# EAGLE design interstage_A1 (EAGLE 9.2.2)
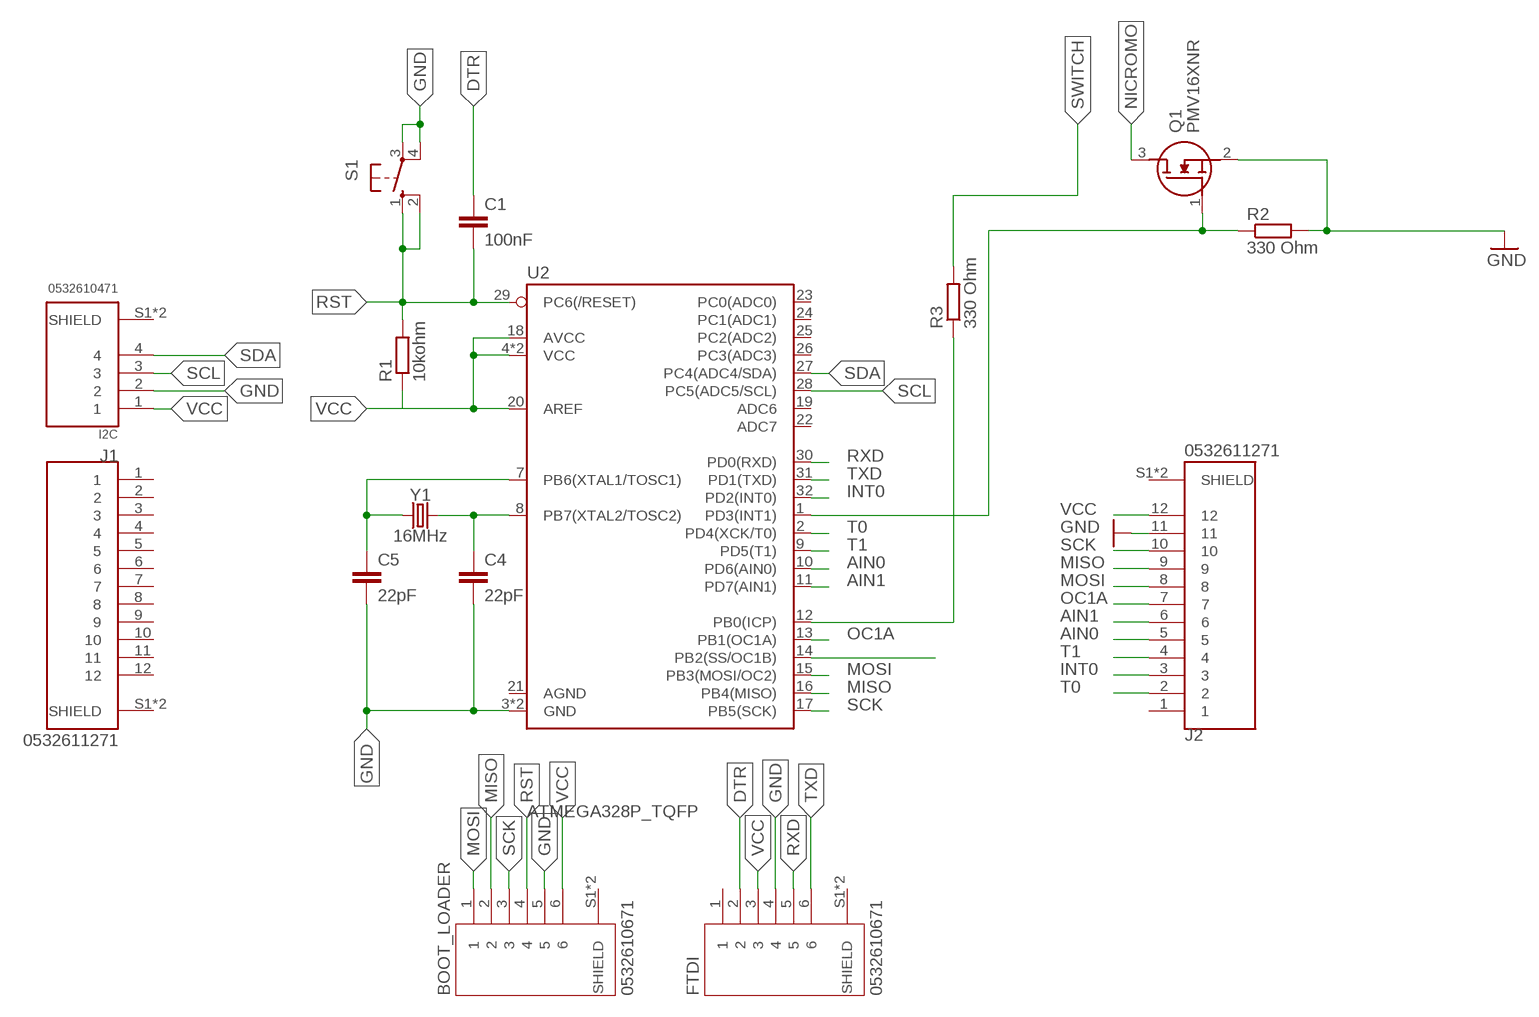
[diagram p0: schematic, sheet 1]

## Parts
BOOT_LOADER  0532610671  [MOLEX_0532610671]
C1  100nF  C-EUC0805K  [C0805K]
C4  22pF  C-EUC0603K  [C0603K]
C5  22pF  C-EUC0603K  [C0603K]
FTDI  0532610671  [MOLEX_0532610671]
I2C  0532610471  [MOLEX_0532610471]
J1  0532611271  [MOLEX_0532611271]
J2  0532611271  [MOLEX_0532611271]
Q1  PMV16XNR  [SOT95P230X110-3N]
R1  10kohm  R-EU_R1206  [R1206]
R2  330 Ohm  R-EU_R1206  [R1206]
R3  330 Ohm  R-EU_R1206  [R1206]
S1  10-XX  [B3F-10XX]
U2  ATMEGA328P_TQFP  [TQFP32-08]
Y1  16MHz  CRYSTAL-16MHZSMD-2X1.6  [CRYSTAL-SMD-2.0X1.6MM]

## Nets
AIN0: J2.5 U2.10(PD6(AIN0))
AIN1: J2.6 U2.11(PD7(AIN1))
DTR: C1.1 FTDI.2
GND: BOOT_LOADER.5 C4.2 C5.2 FTDI.4 I2C.2 J2.11 Q1.2(S) R2.2 S1.3(P) S1.4(P1) U2.3(GND) U2.5(GND)
ICP: R3.1 U2.12(PB0(ICP))
INT0: J2.3 U2.32(PD2(INT0))
INT1: Q1.1(G) R2.1 U2.1(PD3(INT1))
MISO: BOOT_LOADER.2 J2.9 U2.16(PB4(MISO))
MOSI: BOOT_LOADER.1 J2.8 U2.15(PB3(MOSI/OC2))
N$1: C5.1 U2.7(PB6(XTAL1/TOSC1)) Y1.1
N$2: C4.1 U2.8(PB7(XTAL2/TOSC2)) Y1.3
N$6: U2.14(PB2(SS/OC1B))
NICROMO: Q1.3(D)
OC1A: J2.7 U2.13(PB1(OC1A))
RST: BOOT_LOADER.4 C1.2 R1.2 S1.1(S) S1.2(S1) U2.29(PC6(/RESET))
RXD: FTDI.5 U2.30(PD0(RXD))
SCK: BOOT_LOADER.3 J2.10 U2.17(PB5(SCK))
SCL: I2C.3 U2.28(PC5(ADC5/SCL))
SDA: I2C.4 U2.27(PC4(ADC4/SDA))
SWITCH: R3.2
T0: J2.2 U2.2(PD4(XCK/T0))
T1: J2.4 U2.9(PD5(T1))
TXD: FTDI.6 U2.31(PD1(TXD))
VCC: BOOT_LOADER.6 FTDI.3 I2C.1 J2.12 R1.1 U2.4(VCC) U2.6(VCC) U2.18(AVCC) U2.20(AREF)
Unconnected: BOOT_LOADER.S1(SHIELD) BOOT_LOADER.S2(SHIELD) FTDI.1 FTDI.S1(SHIELD) FTDI.S2(SHIELD) I2C.S1(SHIELD) I2C.S2(SHIELD) J1.1 J1.2 J1.3 J1.4 J1.5 J1.6 J1.7 J1.8 J1.9 J1.10 J1.11 J1.12 J1.S1(SHIELD) J1.S2(SHIELD) J2.1 J2.S1(SHIELD) J2.S2(SHIELD) U2.19(ADC6) U2.21(AGND) U2.22(ADC7) U2.23(PC0(ADC0)) U2.24(PC1(ADC1)) U2.25(PC2(ADC2)) U2.26(PC3(ADC3))

## Library data of the parts
BOOT_LOADER FTDI = picoblade6:0532610671: 1.25mm Pitch PicoBlade™ Header, Surface Mount, Right Angle, 6 Circuits; DESCRIPTION: Picoblade Connector, 6 Circuit Single Row, Right Angle Surface Mount SMT PCB; DIGI-KEY_PART_NUMBER: WM7624CT-ND; DIGI-KEY_PURCHASE_URL: https://www.digikey.com/product-detail/en/molex/0532610671/WM7624CT-ND/699111?utm_source=snapeda&utm_medium=aggregator&utm_campaign=symbol; MF: Molex; MP: 0532610671; PACKAGE: None
C1 C4 C5 = rcl:C-EU: CAPACITOR, European symbol; SPICEPREFIX: C
I2C = 0532610471:0532610471: Conn Shrouded Header HDR 4 POS 1.25mm Solder RA SMD PicoBlade™ Embossed T/R; AVAILABILITY: Unavailable; DESCRIPTION: Picoblade Connector, 4 Circuit Single Row, Right Angle Surface Mount SMT PCB; MF: Molex; MP: 0532610471; PACKAGE: None; PRICE: None
J1 J2 = picoblade:0532611271: Conn Shrouded Header HDR 12 POS 1.25mm Solder RA SMD PicoBlade; AVAILABILITY: Unavailable; DESCRIPTION: Picoblade Connector, 12 Circuit Single Row, Right Angle Surface Mount SMT PCB; MF: Molex; MP: 0532611271; PACKAGE: None; PRICE: None
Q1 = SamacSys_Parts:PMV16XNR: Nexperia PMV16XNR N-channel MOSFET, 8.6 A, 20 V PMV16XN, 3-Pin SOT-23 Source: Datasheet <https://componentsearchengine.com/Datasheets/1/PMV16XNR.pdf>; DESCRIPTION: Nexperia PMV16XNR N-channel MOSFET, 8.6 A, 20 V PMV16XN, 3-Pin SOT-23; HEIGHT: 1.1mm; MANUFACTURER_NAME: Nexperia; MANUFACTURER_PART_NUMBER: PMV16XNR; MOUSER_PART_NUMBER: 771-PMV16XNR; MOUSER_PRICE-STOCK: https://www.mouser.com/Search/Refine.aspx?Keyword=771-PMV16XNR
R1-R3 = rcl:R-EU_: RESISTOR, European symbol; SPICEPREFIX: R
S1 = switch-omron:10-XX: OMRON SWITCH; MPN: B3F-1000; OC_FARNELL: 176432; OC_NEWARK: 36M3542
U2 = SparkFun-IC-Microcontroller:ATMEGA328P_TQFP: Popular 328P in QFP Storefront component: ATmega328 - TQFP <https://www.sparkfun.com/products/13448> (COM-13448) Datasheet <http://www.sparkfun.com/datasheets/Components/SMD/ATMega328.pdf> SparkFun Products SparkFun RedBoard - Programmed with Arduino <https://www.sparkfun.com/products/12757> (DEV-12757) Arduino Pro Mini 328 - 5V/16MHz <https://www.sparkfun.com/products/11113> (DEV-11113) Arduino Pro Mini 328 - 3.3V/8MHz <https://www.sparkfun.com/products/11114> (DEV-11114) SparkFun OpenLog <https://www.sparkfun.com/products/13712> (DEV-13712) SparkFun MicroView - OLED Arduino Module <https://www.sparkfun.com/products/12923> (DEV-12923) SparkFun Digital Sandbox <https://www.sparkfun.com/products/12651> (DEV-12651) SparkFun PicoBoard <https://www.sparkfun.com/products/11888> (WIG-11888) Arduino Fio <https://www.sparkfun.com/products/10116> (DEV-10116) LilyPad Arduino 328 Main Board <https://www.sparkfun.com/products/13342> (DEV-13342) SparkFun RedStick <https://www.sparkfun.com/products/13741> (DEV-13741) LilyPad MP3 <https://www.sparkfun.com/products/11013> (DEV-11013) LilyPad Arduino SimpleSnap <https://www.sparkfun.com/products/10941> (DEV-10941) SparkFun Stepoko <https://www.sparkfun.com/products/13899> (ROB-13899) SparkFun Geiger Counter <https://www.sparkfun.com/products/11345> (SEN-11345) SparkFun EL Sequencer <https://www.sparkfun.com/products/12781> (COM-12781) Arduino Pro 328 - 5V/16MHz <https://www.sparkfun.com/products/10915> (DEV-10915) CryptoCape <https://www.sparkfun.com/products/12773> (DEV-12773) SparkFun IR Thermometer Evaluation Board - MLX90614 <https://www.sparkfun.com/products/10740> (SEN-10740) SparkFun RedBot Mainboard <https://www.sparkfun.com/products/12097> (ROB-12097) Arduino Pro 328 - 3.3V/8MHz <https://www.sparkfun.com/products/10914> (DEV-10914) SparkFun Block for Intel® Edison - Arduino <https://www.sparkfun.com/products/13036> (DEV-13036) SparkFun Simon Says - Surface Mount Soldering Kit <https://www.sparkfun.com/products/10935> (KIT-10935) SparkFun 7-Segment Serial Display - Red <https://www.sparkfun.com/products/11441> (COM-11441) SparkFun 7-Segment Serial Display - White <https://www.sparkfun.com/products/11629> (COM-11629) SparkFun 7-Segment Serial Display - Yellow <https://www.sparkfun.com/products/11443> (COM-11443) SparkFun 7-Segment Serial Display - Kelly Green <https://www.sparkfun.com/products/11440> (COM-11440) SparkFun 7-Segment Serial Display - Blue <https://www.sparkfun.com/products/11442> (COM-11442) SparkFun OpenSegment Serial Display - 20mm (Blue) <https://www.sparkfun.com/products/11647> (COM-11647) SparkFun OpenSegment Serial Display - 20mm (Green) <https://www.sparkfun.com/products/11646> (COM-11646) SparkFun OpenSegment Serial Display - 20mm (White) <https://www.sparkfun.com/products/11648> (COM-11648) SparkFun OpenSegment Serial Display - 20mm (Red) <https://www.sparkfun.com/products/11644> (COM-11644) SparkFun OpenSegment Serial Display - 20mm (Yellow) <https://www.sparkfun.com/products/11645> (COM-11645) SparkFun OpenSegment Shield <https://www.sparkfun.com/products/13190> (DEV-13190); PROD_ID: IC-09069
Y1 = SparkFun-Clocks:CRYSTAL-16MHZ: 16MHz Crystal Digikey Example <http://www.digikey.com/product-search/en?keywords=535-9122-1-ND> Frequency: 16MHz Frequency Stability: ±50ppm Frequency Tolerance: ±20ppm Load Capacitance: 18pF SparkFun Products: Pro Micro -5V/16MHz <https://www.sparkfun.com/products/12640> SparkFun Serial Enabled LCD Kit <https://www.sparkfun.com/products/10097>; PROD_ID: XTAL-14681

## Board
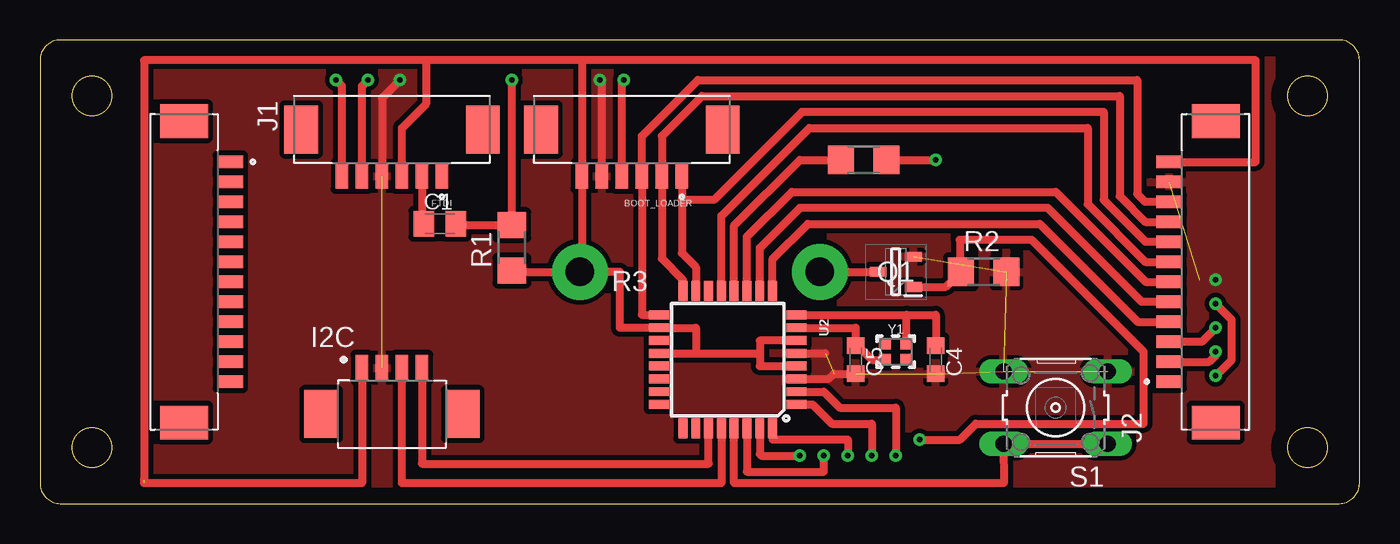
[diagram p1: board, top side]
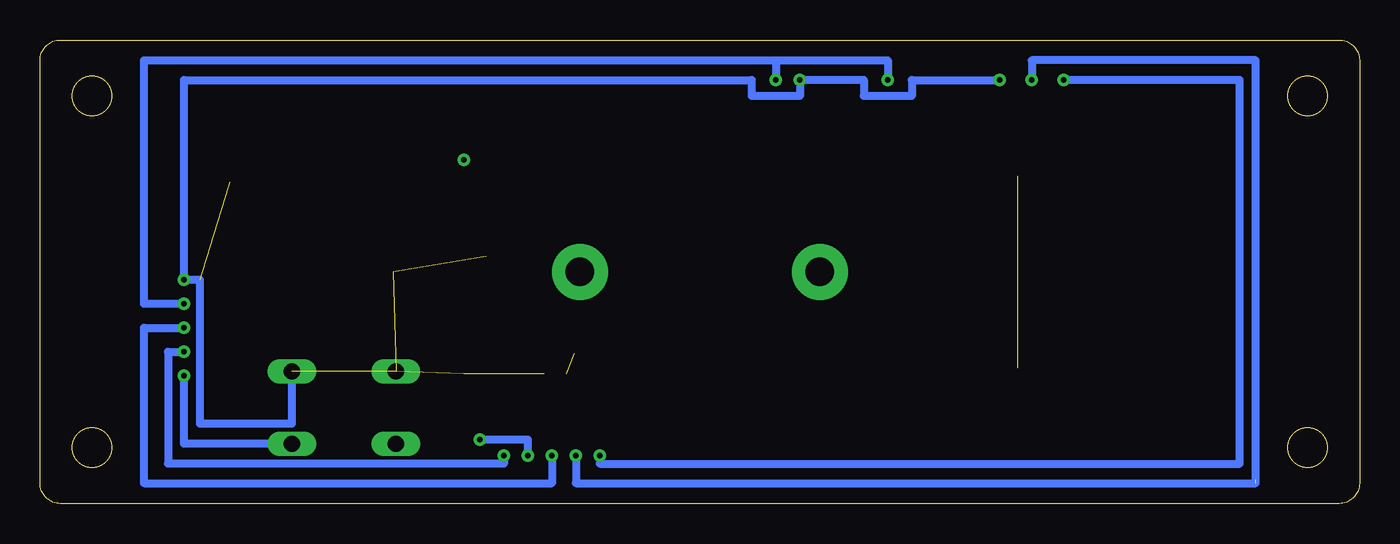
[diagram p2: board, bottom side, seen from below]

Size 82.5 x 29 mm. Coordinates in mm from the lower left corner, seen from the top.
Outline: 0,1.27 arc90 1.27,0 81.23,0 arc90 82.5,1.27 82.5,27.73 arc90 81.23,29 1.27,29 arc90 0,27.73 0,1.27
Outline: circle at 79.25,3.5 radius 1.25
Outline: circle at 3.25,25.5 radius 1.25
Outline: circle at 3.25,3.5 radius 1.25
Outline: circle at 79.25,25.5 radius 1.25
Copper layers (1*16): Top 0.035mm / dielectric 1.5mm / Bottom 0.035mm
Design rules "default": minimum track width 6mil, minimum drill 0.35mm, track to track 6mil, track to pad 6mil, pad to pad 6mil, via to via 6mil, smd to smd 6mil, copper to edge 40mil, drill to drill 6mil, minimum pad ring 10mil, minimum via ring 8mil, stop-mask expansion 4mil, vias tented up to drill 0mil, thermal gap 10mil

### Footprints (pad centres in the part's own frame; a part is rotated, then mirrored left to right if it is on the bottom)
MOLEX_0532610671 = smd 0.8 x 1.6: 1 -3.125,0; 2 -1.875,0; 3 -0.625,0; 4 0.625,0; 5 1.875,0; 6 3.125,0 | smd 2.1 x 3: S1 -5.675,-2.9; S2 5.675,-2.9
C0805K = smd 1.3 x 1.6: 1 -1,0; 2 1,0
C0603K = smd 1.05 x 1.08: 1 -0.875,0; 2 0.875,0
MOLEX_0532610471 = smd 0.8 x 1.6: 1 -1.875,0; 2 -0.625,0; 3 0.625,0; 4 1.875,0 | smd 2.1 x 3: S1 -4.425,-2.9; S2 4.425,-2.9
MOLEX_0532611271 = smd 0.8 x 1.6: 1 -6.875,2.9; 2 -5.625,2.9; 3 -4.375,2.9; 4 -3.125,2.9; 5 -1.875,2.9; 6 -0.625,2.9; 7 0.625,2.9; 8 1.875,2.9; 9 3.125,2.9; 10 4.375,2.9; 11 5.625,2.9; 12 6.875,2.9 | smd 2.1 x 3: S1 -9.425,0; S2 9.425,0
SOT95P230X110-3N = smd 1.05 x 0.6: 1 -1.1,0.95; 2 -1.1,-0.95; 3 1.1,0
R1206 = smd 1.6 x 1.803: 1 -1.422,0; 2 1.422,0
B3F-10XX = drill 1.016 long: 1 -3.251,2.261; 2 3.251,2.261; 3 -3.251,-2.261; 4 3.251,-2.261
TQFP32-08 = smd 1.27 x 0.559: 1 -4.293,2.8; 2 -4.293,2; 3 -4.293,1.2; 4 -4.293,0.4; 5 -4.293,-0.4; 6 -4.293,-1.2; 7 -4.293,-2; 8 -4.293,-2.8; 17 4.293,-2.8; 18 4.293,-2; 19 4.293,-1.2; 20 4.293,-0.4; 21 4.293,0.4; 22 4.293,1.2; 23 4.293,2; 24 4.293,2.8 | smd 0.559 x 1.27: 9 -2.8,-4.293; 10 -2,-4.293; 11 -1.2,-4.293; 12 -0.4,-4.293; 13 0.4,-4.293; 14 1.2,-4.293; 15 2,-4.293; 16 2.8,-4.293; 25 2.8,4.293; 26 2,4.293; 27 1.2,4.293; 28 0.4,4.293; 29 -0.4,4.293; 30 -1.2,4.293; 31 -2,4.293; 32 -2.8,4.293
CRYSTAL-SMD-2.0X1.6MM = smd 0.75 x 0.7: 1 -0.675,-0.5; 2 0.675,-0.5; 3 0.675,0.5; 4 -0.675,0.5

### Placement (x,y rotation side)
BOOT_LOADER  37,20.5 180 top
C1  25,17.5 0 top
C4  56,9 270 top
C5  51,9 270 top
FTDI  22,20.5 180 top
I2C  22,8.5 0 top
J1  9,14.5 270 top
J2  73.5,14.5 90 top
Q1  53.5,14.5 180 top
R1  29.5,16 90 top
R2  59,14.5 0 top
R3  51.5,21.5 0 top
S1  63.5,6 180 top
U2  43,9 180 top
Y1  53.5,9.5 0 top

### Tracks (layer width: path | path; a pad name or v marks a point on that pad's centre or on a via)
AIN0
  Top 0.5: 70.47,12.5 J2.5 68.88,12.62 63,18.5 47.5,18.5 45,16 U2.10
AIN1
  Top 0.5: U2.11 44.2,16.7 47,19.5 63.5,19.5 69.12,13.88 J2.6
DTR
  Top 0.5: C1.1 24,17.38 23.88,17.5 FTDI.2
GND  (via drill 0.35)  (8 unrouted)
  Top 0.5: U2.5 49.1,9.4 | C5.2 49.62,8.12 49.3,7.8 U2.3 | BOOT_LOADER.5 35.12,26.5 v35,26.5 | v22.5,26.5 21.38,25.38 FTDI.4
  Bottom 0.5: v22.5,26.5 28,26.5 28,25.5 31,25.5 31,26.5 v35,26.5 35,25.5 38,25.5 38,26.5 73.5,26.5 v73.5,14 72.5,14 72.5,5 66.75,5 S1.3
  pour Top (isolate 0.305): 6,28.5 6,0.5 77,0.5 77,28.5
ICP
  Top 0.5: R3.1 47.5,21.5 43.4,17.4 U2.12
INT0  (via drill 0.35)
  Top 0.5: U2.32 45.8,4 50.5,4 v50.5,3 | v73.5,11 72.62,10.12 J2.3
  Bottom 0.5: v50.5,3 50.5,1.27 76,1.27 76,11 v73.5,11
INT1  (via drill 0.35)
  Top 0.5: Q1.1 56.63,13.55 R2.1 57.5,14.58 57.5,16.5 62,16.5 69,9.5 69,5 58.5,5 57.5,4 v55,4 | U2.1 48.3,6.2 49.5,5 52,5 v52,3
  Bottom 0.5: v52,3 52,4 v55,4
MISO
  Top 0.5: U2.16 40.2,14 38.88,15.32 BOOT_LOADER.2 38.88,23 41.38,25.5 67.5,25.5 67.5,19.23 69.1,17.62 J2.9
MOSI
  Top 0.5: J2.8 69.12,16.38 66.5,19 66.5,24.5 47.62,24.5 42.12,19 40.12,19 | U2.15 41,14.79 40.12,15.67 40.12,19 | BOOT_LOADER.1 40.12,19
N$1
  Top 0.5: U2.7 51,11 C5.1 51.12,9.88 52,9 Y1.1
N$2
  Top 0.5: U2.8 54.17,11.8 | Y1.3 54.17,11.8 | C4.1 56,11.8 54.17,11.8
NICROMO  (via drill 1.8 pad 3.5)
  Top 0.5: 50.5,14.5 v48.75,14.5 Q1.3
OC1A
  Top 0.5: J2.7 69.1,15.12 65.5,18.73 65.5,23.5 48.1,23.5 42.6,18 U2.13
RST  (via drill 0.35)
  Top 0.5: U2.29 43.4,1.27 60.26,1.27 S1.2 S1.1 | BOOT_LOADER.4 36.38,26.5 v36.5,26.5 | C1.2 26.08,17.42 R1.2 v29.5,26.5 | v73.5,8 74.5,9 74.5,11.5 v73.5,12.5
  Bottom 0.5: S1.1 73.5,3.74 v73.5,8 | v73.5,12.5 76,12.5 76,27.73 36.5,27.73 | 36.5,27.73 v36.5,26.5 | 36.5,27.73 29.5,27.73 v29.5,26.5
RXD  (via drill 0.35)
  Top 0.5: U2.30 44.2,2 49,2 v49,3 | FTDI.5 20.12,26.12 v20.5,26.5
  Bottom 0.5: v49,3 49,1.27 6.5,1.27 6.5,27.73 20.5,27.73 v20.5,26.5
SCK
  Top 0.5: U2.17 37.62,11.8 BOOT_LOADER.3 37.62,23 40.06,25.44 41.12,26.5 68.6,26.5 68.6,19.38 69.1,18.88 J2.10
SCL
  Top 0.5: U2.28 42.6,1.27 22.62,1.27 I2C.3
SDA
  Top 0.5: U2.27 41.8,2.5 23.88,2.5 I2C.4
SWITCH  (via drill 0.35)
  Top 0.5: R3.2 v56,21.5
T0  (via drill 0.35)
  Top 0.5: J2.2 73.1,8.88 73.5,9.28 v73.5,9.5 | U2.2 49,7 50,6 53.5,6 v53.5,3
  Bottom 0.5: v73.5,9.5 74.5,9.5 74.5,2.5 53.5,2.5 v53.5,3
T1
  Top 0.5: U2.9 45.8,15.3 48,17.5 62.5,17.5 68.62,11.38 J2.4
TXD  (via drill 0.35)
  Top 0.5: v47.5,3 45.1,3 45,3.1 U2.31 | FTDI.6 18.88,26.12 v18.5,26.5
  Bottom 0.5: v47.5,3 47.5,2.5 7.5,2.5 7.5,26.5 v18.5,26.5
VCC  (via drill 1.8 pad 3.5)  (1 unrouted)
  Top 0.5: J2.12 76,21.38 76,27.73 33.88,27.73 | U2.4 45,8.6 45,9.4 | U2.6 45,10.2 45,9.4 | U2.20 41,9.4 | 41,9.4 45,9.4 | 41,9.4 41,11 U2.18 36.25,11 36.25,14.5 33.88,14.5 | I2C.1 20.12,1.27 6.5,1.27 | 33.88,27.73 BOOT_LOADER.6 | 33.88,27.73 24.12,27.73 | 24.12,27.73 6.5,27.73 6.5,1.5 | 24.12,27.73 24.12,25 22.62,23.5 FTDI.3 | 33.75,20.38 BOOT_LOADER.6 | BOOT_LOADER.6 33.88,14.62 | 33.88,14.62 33.88,14.5 | 33.88,14.62 v33.75,14.5 | R1.1 29.58,14.5 33.88,14.5